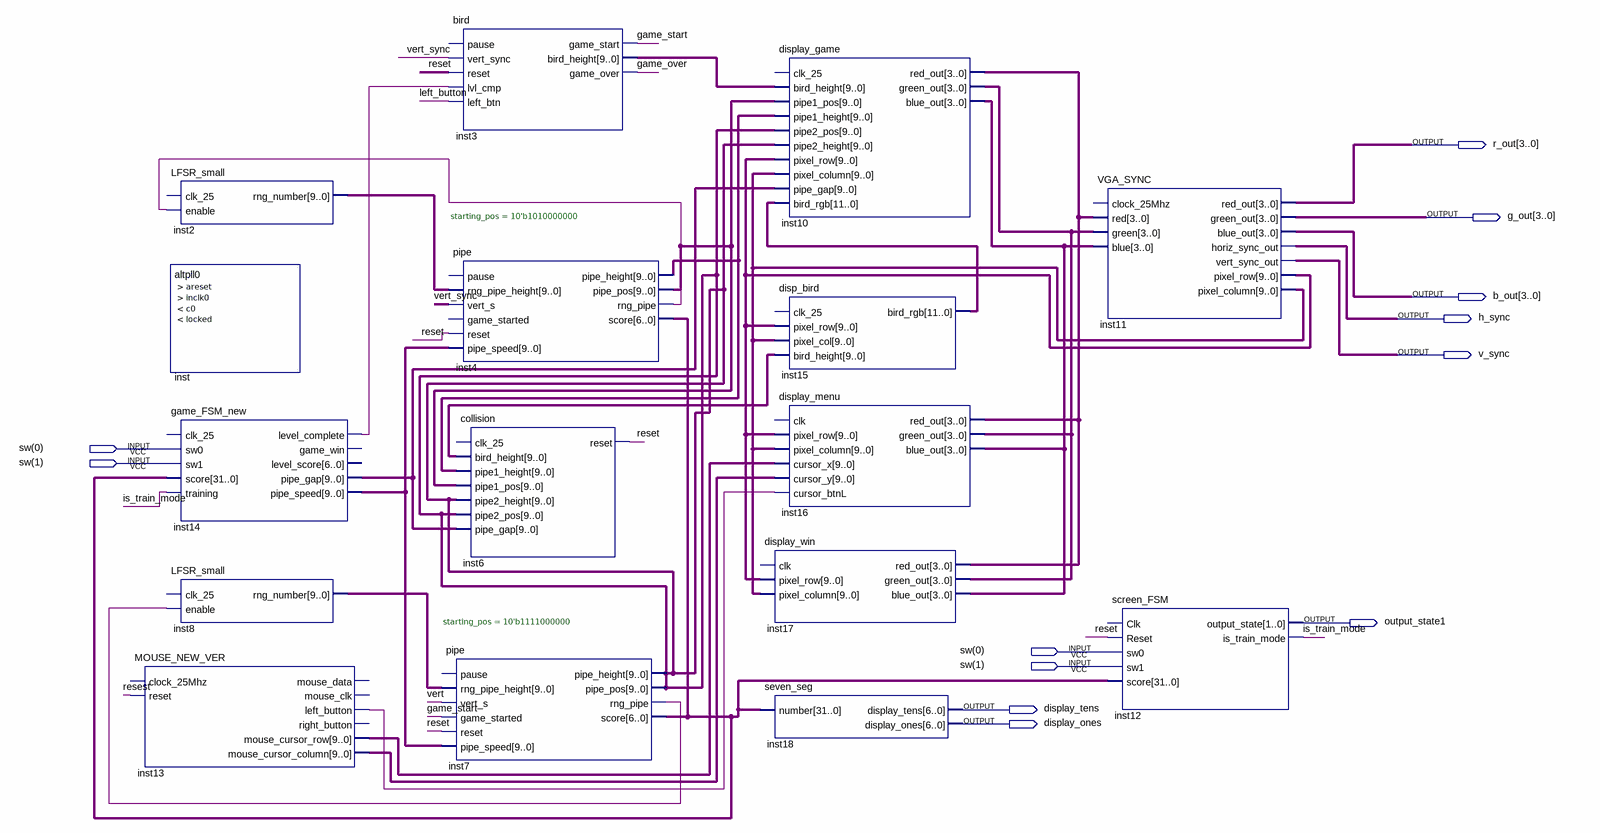
[diagram p0: schematic sheet]
// Quartus schematic flappy_schematic.bdf as structural Verilog: 16 symbols, 12 pins
module flappy_schematic (
  input  \sw(0) ,
  input  \sw(1) ,
  output [3:0] r_out,
  output [3:0] g_out,
  output [3:0] b_out,
  output h_sync,
  output v_sync,
  output output_state1,
  output display_tens,
  output display_ones
);

  wire game_over, game_start, inst4_rng_pipe, inst7_rng_pipe, inst13_left_button, inst14_level_complete,
       is_train_mode, left_button, resest, reset, undriven_2, vert, vert_sync;
  wire [3:0] inst10_blue_out, inst10_green_out, inst10_red_out;
  wire [9:0] inst2_rng_number, inst3_bird_height, inst4_pipe_height, inst4_pipe_pos, inst7_pipe_height,
       inst8_rng_number, inst11_pixel_column, inst11_pixel_row, inst13_mouse_cursor_column,
       inst13_mouse_cursor_row, inst14_pipe_gap, inst14_pipe_speed, undriven;
  wire [11:0] inst15_bird_rgb;
  wire [31:0] inst4_score;

  MOUSE_NEW_VER inst13 (
    .reset(resest), .left_button(inst13_left_button), .mouse_cursor_row(inst13_mouse_cursor_row),
    .mouse_cursor_column(inst13_mouse_cursor_column));  // open: clock_25Mhz, right_button, mouse_data, mouse_clk
  LFSR_small inst2 (.enable(undriven_2), .rng_number(inst2_rng_number));  // open: clk_25
  altpll0 inst ();  // open: areset, inclk0, c0, locked
  game_FSM_new inst14 (
    .sw0(\sw(0) ), .sw1(\sw(1) ), .score(inst4_score), .training(is_train_mode),
    .level_complete(inst14_level_complete), .pipe_gap(inst14_pipe_gap), .pipe_speed(inst14_pipe_speed));  // open: clk_25, game_win, level_score
  LFSR_small inst8 (.enable(inst7_rng_pipe), .rng_number(inst8_rng_number));  // open: clk_25
  bird inst3 (
    .vert_sync(vert_sync), .reset(reset), .lvl_cmp(inst14_level_complete), .left_btn(left_button),
    .game_start(game_start), .bird_height(inst3_bird_height), .game_over(game_over));  // open: pause
  pipe #(.starting_pos(10'b1010000000)) inst4 (
    .rng_pipe_height(inst2_rng_number), .vert_s(vert_sync), .reset(reset), .pipe_speed(inst14_pipe_speed),
    .pipe_height(inst4_pipe_height), .pipe_pos(inst4_pipe_pos), .rng_pipe(inst4_rng_pipe), .score(inst4_score));  // open: pause, game_started
  collision inst6 (
    .bird_height(undriven), .pipe1_height(inst4_pipe_height), .pipe1_pos(inst4_pipe_pos),
    .pipe2_height(inst7_pipe_height), .pipe2_pos(inst7_pipe_height), .pipe_gap(inst14_pipe_gap), .reset(reset));  // open: clk_25
  pipe #(.starting_pos(10'b1111000000)) inst7 (
    .rng_pipe_height(inst8_rng_number), .vert_s(vert), .game_started(game_start), .reset(reset),
    .pipe_speed(inst14_pipe_speed), .pipe_height(inst7_pipe_height), .pipe_pos(inst7_pipe_height),
    .rng_pipe(inst7_rng_pipe), .score(inst4_score));  // open: pause
  display_game inst10 (
    .bird_height(inst3_bird_height), .pipe1_pos(inst4_pipe_pos), .pipe1_height(inst4_pipe_height),
    .pipe2_pos(inst7_pipe_height), .pipe2_height(inst7_pipe_height), .pixel_row(inst11_pixel_row),
    .pixel_column(inst11_pixel_column), .pipe_gap(inst14_pipe_gap), .bird_rgb(inst15_bird_rgb),
    .red_out(inst10_red_out), .green_out(inst10_green_out), .blue_out(inst10_blue_out));  // open: clk_25
  disp_bird inst15 (
    .pixel_row(inst11_pixel_row), .pixel_col(inst11_pixel_column), .bird_height(undriven),
    .bird_rgb(inst15_bird_rgb));  // open: clk_25
  display_menu inst16 (
    .pixel_row(inst11_pixel_row), .pixel_column(inst11_pixel_column), .cursor_x(inst13_mouse_cursor_row),
    .cursor_y(inst13_mouse_cursor_column), .cursor_btnL(inst13_left_button), .red_out(inst10_red_out),
    .green_out(inst10_green_out), .blue_out(inst10_blue_out));  // open: clk
  display_win inst17 (
    .pixel_row(inst11_pixel_row), .pixel_column(inst11_pixel_column), .red_out(inst10_red_out),
    .green_out(inst10_green_out), .blue_out(inst10_blue_out));  // open: clk
  seven_seg inst18 (.number(inst4_score), .display_tens(display_tens), .display_ones(display_ones));
  VGA_SYNC inst11 (
    .red(inst10_red_out), .green(inst10_green_out), .blue(inst10_blue_out), .red_out(r_out),
    .green_out(g_out), .blue_out(b_out), .horiz_sync_out(h_sync), .vert_sync_out(v_sync),
    .pixel_row(inst11_pixel_row), .pixel_column(inst11_pixel_column));  // open: clock_25Mhz
  screen_FSM inst12 (
    .Reset(reset), .sw0(\sw(0) ), .sw1(\sw(1) ), .score(inst4_score), .output_state(output_state1),
    .is_train_mode(is_train_mode));  // open: Clk
endmodule
